# EAGLE design Rain Alert System (EAGLE 9.6.2)
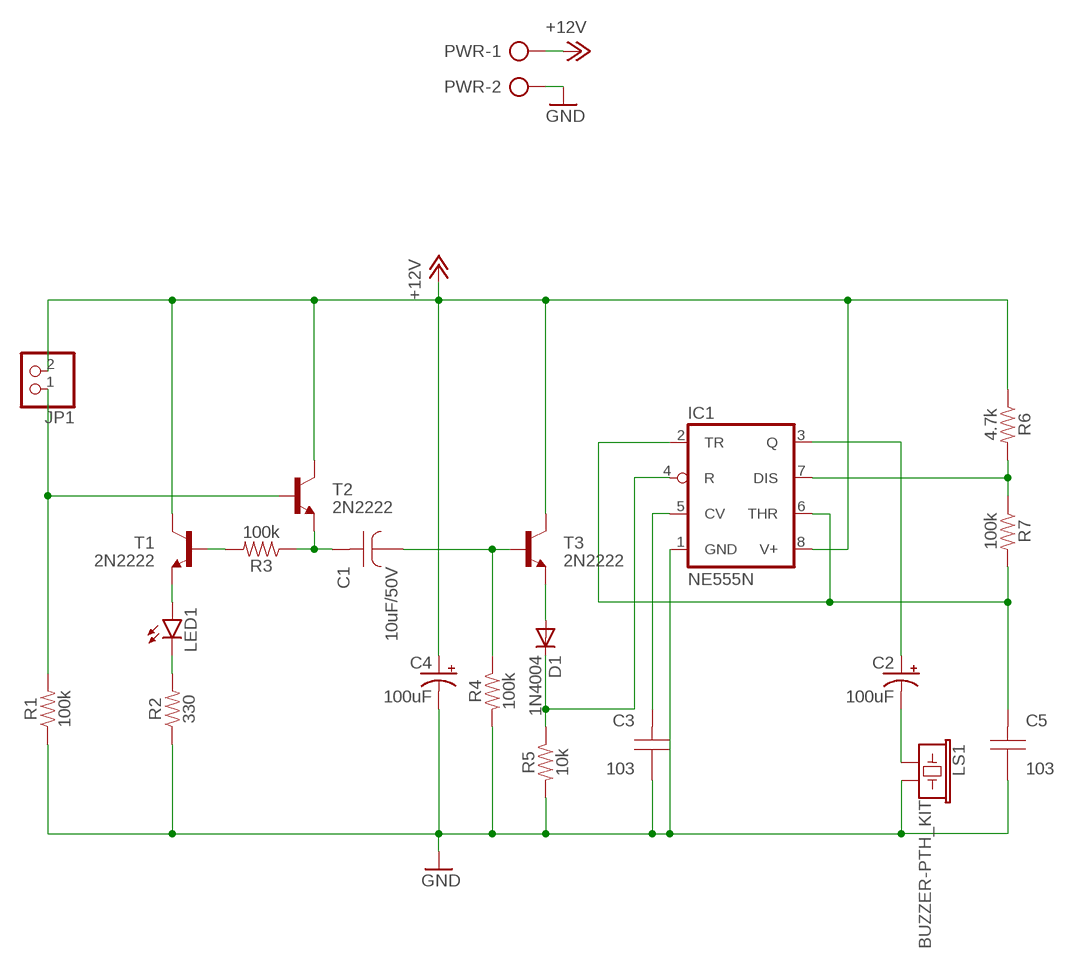
[diagram p0: schematic, sheet 1]

## Parts
C1  10uF/50V  10UF/50V  [D5]
C2  100uF  100UF-POLAR-RADIAL-2.5MM-25V-20%  [CPOL-RADIAL-2.5MM-6.5MM]
C3  103  100NFP2.8  [P2.8]
C4  100uF  100UF-POLAR-RADIAL-2.5MM-25V-20%  [CPOL-RADIAL-2.5MM-6.5MM]
C5  103  100NFP2.8  [P2.8]
D1  1N4004  [DO41-10]
IC1  NE555N  [DIL08-ROUND]
JP1  PINHD-1X2/90  [1X02/90]
LED1  LED5MM  [LED5MM]
LS1  BUZZER-PTH_KIT  [BUZZER-12MM-KIT]
PWR  2P  [2P]
R1  100k  RESISTORAXIAL-0.3  [AXIAL-0.3]
R2  330  RESISTORAXIAL-0.3  [AXIAL-0.3]
R3  100k  RESISTORAXIAL-0.3  [AXIAL-0.3]
R4  100k  RESISTORAXIAL-0.3  [AXIAL-0.3]
R5  10k  RESISTORAXIAL-0.3  [AXIAL-0.3]
R6  4.7k  RESISTORAXIAL-0.3  [AXIAL-0.3]
R7  100k  RESISTORAXIAL-0.3  [AXIAL-0.3]
T1  2N2222  [TO92-EBC-OVAL]
T2  2N2222  [TO92-EBC-OVAL]
T3  2N2222  [TO92-EBC-OVAL]

## Nets
+12V: C4.1(+) IC1.8(V+) JP1.2 PWR.1 R6.P$1 T1.C T2.C T3.C
GND: C3.2(K1) C4.2(-) C5.2(K1) IC1.1(GND) LS1.- PWR.2 R1.P$1 R2.P$1 R4.P$2 R5.P$2
N$1: LED1.K(C) R2.P$2
N$2: JP1.1 R1.P$2 T2.B
N$3: LED1.A T1.E
N$4: R3.P$2 T1.B
N$5: C1.A R3.P$1 T2.E
N$6: C1.K R4.P$1 T3.B
N$7: D1.C IC1.4(R) R5.P$1
N$8: D1.A T3.E
N$9: C2.2(-) LS1.+
N$10: C2.1(+) IC1.3(Q)
N$11: C3.1(A1) IC1.5(CV)
N$12: IC1.7(DIS) R6.P$2 R7.P$1
N$13: C5.1(A1) IC1.2(TR) IC1.6(THR) R7.P$2

## Library data of the parts
C1 = Capacitors:10UF/50V
C2 C4 = SparkFun-Capacitors:100UF-POLAR: 100µF polarized capacitors A capacitor is a passive two-terminal electrical component used to store electrical energy temporarily in an electric field.; PROD_ID: CAP-08439
C3 C5 = Capacitors:100NF
D1 = adafruit:1N4004: DIODE General purpose 1N400x type rectifier (With bigger pads) http://www.ladyada.net/library/pcb/eaglelibrary.html
IC1 = adafruit:*555: TIMER Changed DIP package to have round (not oval) pin pads http://www.ladyada.net/library/pcb/eaglelibrary.html
JP1 = pinhead:PINHD-1X2: PIN HEADER
LED1 = led:LED: LED OSRAM: - CHIPLED LG R971, LG N971, LY N971, LG Q971, LY Q971, LO R971, LY R971 LH N974, LH R974 LS Q976, LO Q976, LY Q976 LO Q996 - Hyper CHIPLED LW Q18S LB Q993, LB Q99A, LB R99A - SideLED LS A670, LO A670, LY A670, LG A670, LP A670 LB A673, LV A673, LT A673, LW A673 LH A674 LY A675 LS A676, LA A676, LO A676, LY A676, LW A676 LS A679, LY A679, LG A679 - Hyper Micro SIDELED® LS Y876, LA Y876, LO Y876, LY Y876 LT Y87S - SmartLED LW L88C, LW L88S LB L89C, LB L89S, LG L890 LS L89K, LO L89K, LY L89K LS L896, LA L896, LO L896, LY L896 - TOPLED LS T670, LO T670, LY T670, LG T670, LP T670 LSG T670, LSP T670, LSY T670, LOP T670, LYG T670 LG T671, LOG T671, LSG T671 LB T673, LV T673, LT T673, LW T673 LH T674 LS T676, LA T676, LO T676, LY T676, LB T676, LH T676, LSB T676, LW T676 LB T67C, LV T67C, LT T67C, LS T67K, LO T67K, LY T67K, LW E67C LS E67B, LA E67B, LO E67B, LY E67B, LB E67C, LV E67C, LT E67C LW T67C LS T679, LY T679, LG T679 LS T770, LO T770, LY T770, LG T770, LP T770 LB T773, LV T773, LT T773, LW T773 LH T774 LS E675, LA E675, LY E675, LS T675 LS T776, LA T776, LO T776, LY T776, LB T776 LHGB T686 LT T68C, LB T68C - Hyper Mini TOPLED® LB M676 - Mini TOPLED Santana® LG M470 LS M47K, LO M47K, LY M47K Source: http://www.osram.convergy.de LUXEON: - LUMILED® LXK2-PW12-R00, LXK2-PW12-S00, LXK2-PW14-U00, LXK2-PW14-V00 LXK2-PM12-R00, LXK2-PM12-S00, LXK2-PM14-U00 LXK2-PE12-Q00, LXK2-PE12-R00, LXK2-PE12-S00, LXK2-PE14-T00, LXK2-PE14-U00 LXK2-PB12-K00, LXK2-PB12-L00, LXK2-PB12-M00, LXK2-PB14-N00, LXK2-PB14-P00, LXK2-PB14-Q00 LXK2-PR12-L00, LXK2-PR12-M00, LXK2-PR14-Q00, LXK2-PR14-R00 LXK2-PD12-Q00, LXK2-PD12-R00, LXK2-PD12-S00 LXK2-PH12-R00, LXK2-PH12-S00 LXK2-PL12-P00, LXK2-PL12-Q00, LXK2-PL12-R00 Source: www.luxeon.com KINGBRIGHT: KA-3528ASYC Source: www.kingbright.com
LS1 = SparkFun-Electromechanical:BUZZER: Buzzer Small round buzzers that operate around the audible 2kHz range. You can use these as speakers to create simple music or user interfaces. Variant Overview: PTH - Mini Speaker - PC Mount 12mm 2.048kHz <https://www.sparkfun.com/products/7950> PTH_KIT - Mini Speaker - PC Mount 12mm 2.048kHz <https://www.sparkfun.com/products/7950> KIT simplifies soldering by adding stop mask to one side of the pads. PTH_NO_SILK - Mini Speaker - PC Mount 12mm 2.048kHz <https://www.sparkfun.com/products/7950> No silkscreen indicator of buzzer outline. PTH_KIT_NO_SILK - Mini Speaker - PC Mount 12mm 2.048kHz <https://www.sparkfun.com/products/7950> KIT package w/o silkscreen SMD - Buzzer Audio Magnetic (CCV-084B16) SMD buzzer used on, e.g. the LilyPad Buzzer <https://www.sparkfun.com/products/8463> and RFID USB Reader <https://www.sparkfun.com/products/9963>. SMD_KIT - Buzzer Audio Magnetic (CCV-084B16) SMD Buzzer with elongated pins to make soldering easier. Used on the SparkFun Simon Says - Surface Mount Soldering Kit <https://www.sparkfun.com/products/10935>.; PROD_ID: COMP-08253; SF_SKU: COM-07950
PWR = Terminal Block:2P: CONNECTOR
R1-R7 = SparkFun-Resistors:RESISTOR: Generic Resistor Package
T1-T3 = adafruit:2N2222: NPN TRANSISTOR Big oval pads

## Board
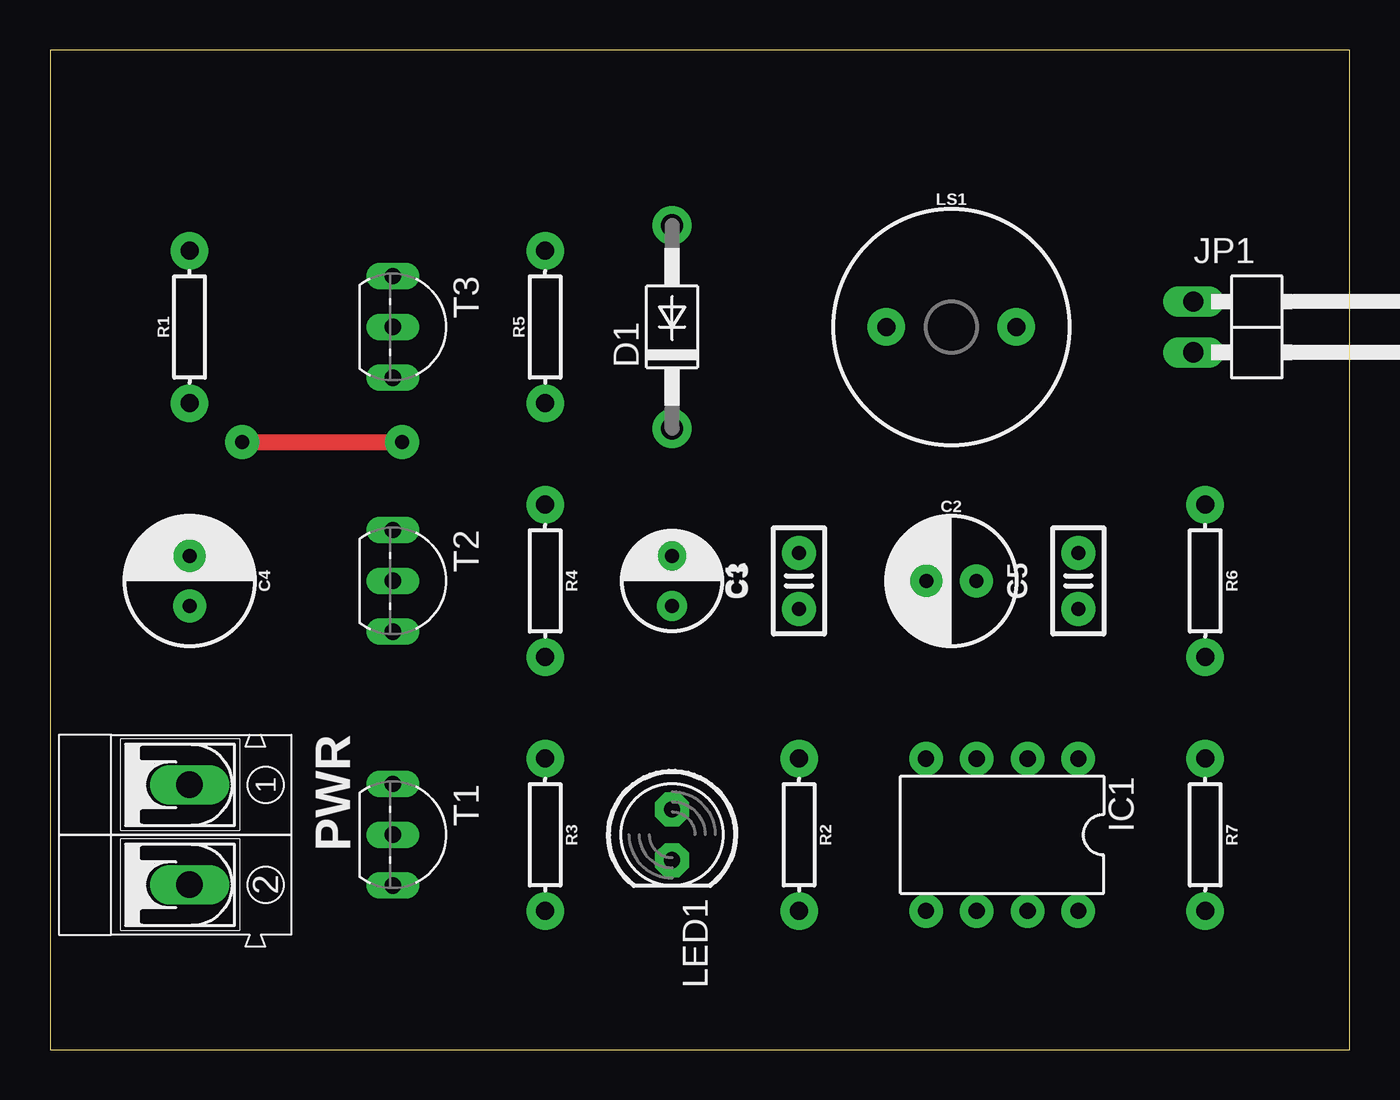
[diagram p1: board, top side]
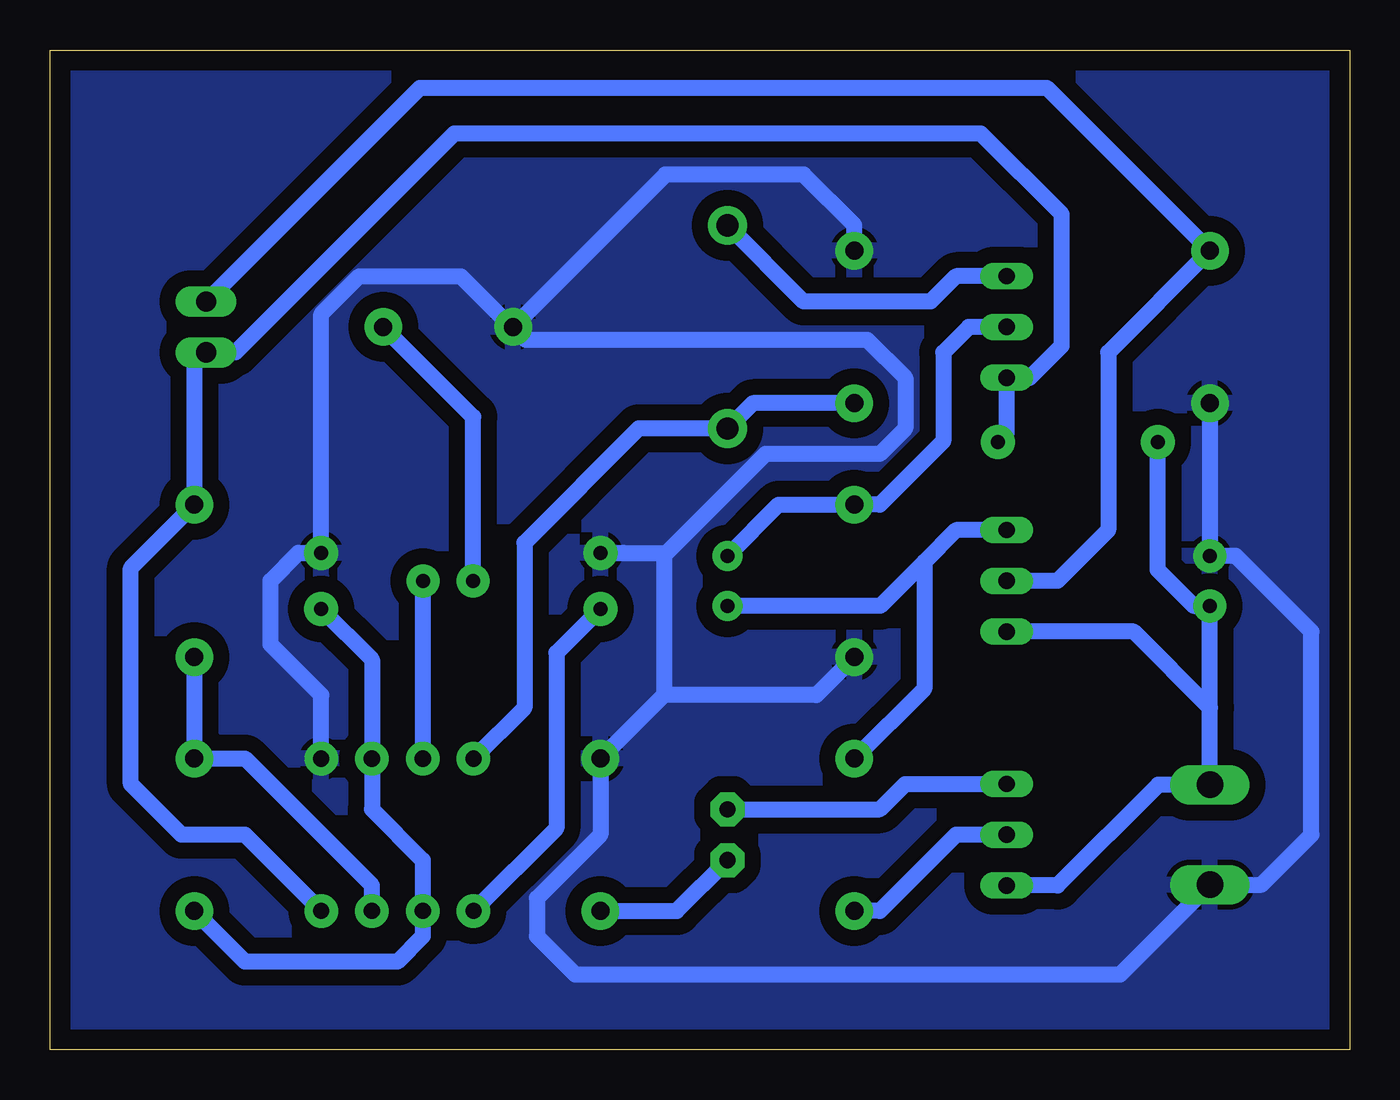
[diagram p2: board, bottom side, seen from below]

Size 65 x 50 mm. Coordinates in mm from the lower left corner, seen from the top.
Outline: 0,0 65,0 65,50 0,50 0,0
Copper layers (1*16): Top 0.035mm / dielectric 1.5mm / Bottom 0.035mm
Design rules "default *": minimum track width 0.8mm, minimum drill 0.7mm, track to track 0.8mm, track to pad 0.8mm, pad to pad 0.8mm, via to via 0.8mm, smd to smd 0.8mm, copper to edge 40mil, drill to drill 6mil, minimum pad ring 10mil, minimum via ring 8mil, stop-mask expansion 4mil, vias tented up to drill 0mil, thermal gap 10mil

### Footprints (pad centres in the part's own frame; a part is rotated, then mirrored left to right if it is on the bottom)
D5 = drill 0.7 pad 1.5: A 1.25,0; K -1.25,0
CPOL-RADIAL-2.5MM-6.5MM = drill 0.7 pad 1.651: 1 1.25,0; 2 -1.25,0
P2.8 = drill 0.7 pad 1.7: 1 -1.397,0; 2 1.397,0
DO41-10 = drill 1.118 pad 1.93: A 5.08,0; C -5.08,0
DIL08-ROUND = drill 0.813 pad 1.676: 1 -3.81,-3.81; 2 -1.27,-3.81; 3 1.27,-3.81; 4 3.81,-3.81; 5 3.81,3.81; 6 1.27,3.81; 7 -1.27,3.81; 8 -3.81,3.81
1X02/90 = drill 1.016 long: 1 -1.27,-3.81; 2 1.27,-3.81
LED5MM = drill 0.813 pad 1.7 octagon: A -1.27,0; K 1.27,0
BUZZER-12MM-KIT = drill 0.9 pad 1.88: + 3.25,0; - -3.25,0
2P = drill 1.321 long: 1 -2.5,0; 2 2.5,0
AXIAL-0.3 = drill 0.9 pad 1.88: P$1 -3.81,0; P$2 3.81,0
TO92-EBC-OVAL = drill 0.813 long: B 0,-1.27; C 2.54,-1.27; E -2.54,-1.27

### Placement (x,y rotation side)
C1  31.11,23.45 270 top
C2  45.09,23.45 0 top
C3  37.47,23.45 90 top
C4  6.99,23.45 270 top
C5  51.44,23.45 90 top
D1  31.11,36.15 90 top
IC1  47.62,10.74 180 top
JP1  61,36.15 270 top
LED1  31.11,10.74 270 top
LS1  45.09,36.15 0 top
PWR  6.99,10.74 270 top
R1  6.99,36.15 90 top
R2  37.47,10.74 270 top
R3  24.77,10.74 270 top
R4  24.77,23.45 270 top
R5  24.77,36.15 90 top
R6  57.78,23.45 270 top
R7  57.78,10.74 270 top
T1  18.41,10.74 270 top
T2  18.41,23.45 270 top
T3  18.41,36.15 270 top

### Tracks (layer width: path | path; a pad name or v marks a point on that pad's centre or on a via)
+12V  (via drill 0.7 pad 1.7)
  Top 0.8: v9.6,30.4 v17.6,30.4
  Bottom 0.8: 6.99,17.09 PWR.1 9.56,13.24 14.61,8.21 T1.C | 6.99,17.09 C4.1 | 6.99,17.09 10.79,20.91 T2.C | 7,22.18 C4.1 | IC1.8 55.24,10.74 58.42,10.74 60.96,13.29 60.96,24.08 R6.P$1 57.78,34.28 JP1.2 55.73,34.88 44.78,45.82 18.44,45.82 14.4,41.78 14.4,35.2 15.99,33.6 T3.C 17.14,30.86 v17.6,30.4 | C4.1 7.79,22.2 9.6,24 v9.6,30.4
GND
  Bottom 0.8: R1.P$1 C4.2 5.7,24.7 1.91,20.91 1.91,10.74 4.41,8.24 PWR.2 11.47,3.76 38.73,3.76 40.64,5.67 40.64,7.57 37.47,10.74 R2.P$1 34.29,17.73 | 36.32,24.84 C3.2 34.16,24.84 | 34.29,17.73 34.29,24.71 34.16,24.84 | R5.P$2 24.77,41.23 27.3,43.77 34.22,43.77 LS1.- | IC1.1 51.44,17.73 53.98,20.27 53.98,23.45 52.58,24.84 C5.2 51.44,36.78 49.53,38.69 44.45,38.69 41.91,36.15 LS1.- | LS1.- 41.2,35.51 24.13,35.51 22.23,33.6 22.23,31.07 23.5,29.8 29.21,29.8 34.16,24.84 | R4.P$2 26.67,17.73 34.29,17.73
  pour Bottom (isolate 0.8): 65.96,51.28 0,51.28 0,0 65.96,0
N$1
  Bottom 0.8: R2.P$2 33.66,6.93 LED1.K
N$2
  Bottom 0.8: R1.P$2 12.06,34.88 12.06,25.98 14.61,23.45 T2.B | R1.P$2 6.99,40.26 | 6.96,39.98 R1.P$2 | JP1.1 46.5,48.11 15.14,48.11 R1.P$2
N$3
  Bottom 0.8: LED1.A 23.5,12.02 22.23,13.29 T1.E
N$4
  Bottom 0.8: T1.B 19.68,10.74 23.5,6.93 R3.P$2
N$5
  Bottom 0.8: T2.E 19.68,25.98 21.27,24.4 | 21.27,24.4 23.48,22.2 C1.A | 21.27,24.4 21.27,18.05 R3.P$1
N$6
  Bottom 0.8: C1.K 28.55,27.25 R4.P$1 23.5,27.25 20.32,30.43 20.32,34.88 19.05,36.15 T3.B
N$7
  Bottom 0.8: R5.P$1 29.84,32.34 D1.C 35.56,31.07 41.27,25.35 41.27,17.09 IC1.4
N$8
  Bottom 0.8: T3.E 19.68,38.69 20.95,37.41 27.3,37.41 D1.A
N$9
  Bottom 0.8: C2.2 43.84,31.64 LS1.+
N$10
  Bottom 0.8: C2.1 46.35,23.43 IC1.3
N$11
  Bottom 0.8: C3.1 39.67,19.84 39.67,11.07 IC1.5
N$12
  Bottom 0.8: IC1.7 48.9,8.21 55.24,14.55 R7.P$1 R6.P$2
N$13
  Bottom 0.8: C5.1 48.9,19.51 IC1.2 48.9,12.02 46.35,9.47 IC1.6 46.35,5.67 47.62,4.39 55.24,4.39 R7.P$2